# Altium project SimulationProjects.PrjPcb
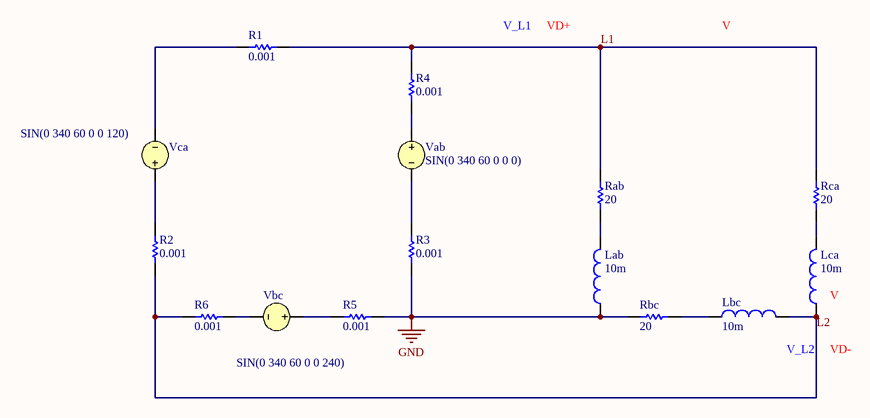
[diagram p0: 3phaseSim.SchDoc]
1 sheet, 15 parts. Net scope: global (net labels, ports and power ports of the same name join across sheets).

## Sheet 3phaseSim.SchDoc
size A; SheetNumber: 1; SheetTotal: 1

### Parts
Lab  value 10m  (hidden comment: Inductor)
Lbc  value 10m  (hidden comment: Inductor)
Lca  value 10m  (hidden comment: Inductor)
R1  value 0.001  (hidden comment: Resistor)
R2  value 0.001  (hidden comment: Resistor)
R3  value 0.001  (hidden comment: Resistor)
R4  value 0.001  (hidden comment: Resistor)
R5  value 0.001  (hidden comment: Resistor)
R6  value 0.001  (hidden comment: Resistor)
Rab  value 20  (hidden comment: Resistor)
Rbc  value 20  (hidden comment: Resistor)
Rca  value 20  (hidden comment: Resistor)
Vab  SIN(0 340 60 0 0 0)
Vbc  SIN(0 340 60 0 0 240)
Vca  SIN(0 340 60 0 0 120)

### Nets
GND: Lab.1 R3.1 R5.2 Rbc.2
L1: R1.2 R4.1 Rab.1 Rca.1
L2: Lbc.2 Lca.1 R2.1 R6.1
NetLab_2: Lab.2 Rab.2
NetLbc_1: Lbc.1 Rbc.1
NetLca_2: Lca.2 Rca.2
NetR1_1: R1.1 Vca.2
NetR2_2: R2.2 Vca.1
NetR3_2: R3.2 Vab.2
NetR4_2: R4.2 Vab.1
NetR5_1: R5.1 Vbc.1
NetR6_2: R6.2 Vbc.2

### Library data of the parts
Lab Lbc Lca = Inductor: SimulationGenericComponent: True
R1-R6 Rab Rbc Rca = Resistor: TC1: 0; SimulationGenericComponent: True; TC2: 0
Vab = VSRC: Voltage Source; Note: PCB Footprint - Not required; AC Magnitude: 340; AC Phase: 0; Frequency: 60; Published: 8-Jun-2000; LatestRevisionDate: 17-Jul-2002; LatestRevisionNote: Re-released for DXP Platform.; PackageReference: Not Applicable; Publisher: Altium Limited; DC Magnitude: 0; Offset: 0; Amplitude: 340; Delay: 0; Damping Factor: 0; Phase: 0
Vbc = VSRC: Voltage Source; Note: PCB Footprint - Not required; AC Magnitude: 340; AC Phase: 240; DC Magnitude: 0; Frequency: 60; Published: 8-Jun-2000; LatestRevisionDate: 17-Jul-2002; LatestRevisionNote: Re-released for DXP Platform.; PackageReference: Not Applicable; Publisher: Altium Limited; Offset: 0; Amplitude: 340; Delay: 0; Damping Factor: 0; Phase: 240
Vca = VSRC: Voltage Source; Note: PCB Footprint - Not required; AC Magnitude: 340; AC Phase: 120; DC Magnitude: 0; Frequency: 60; Published: 8-Jun-2000; LatestRevisionDate: 17-Jul-2002; LatestRevisionNote: Re-released for DXP Platform.; PackageReference: Not Applicable; Publisher: Altium Limited; Offset: 0; Delay: 0; Damping Factor: 0; Phase: 120; Amplitude: 340